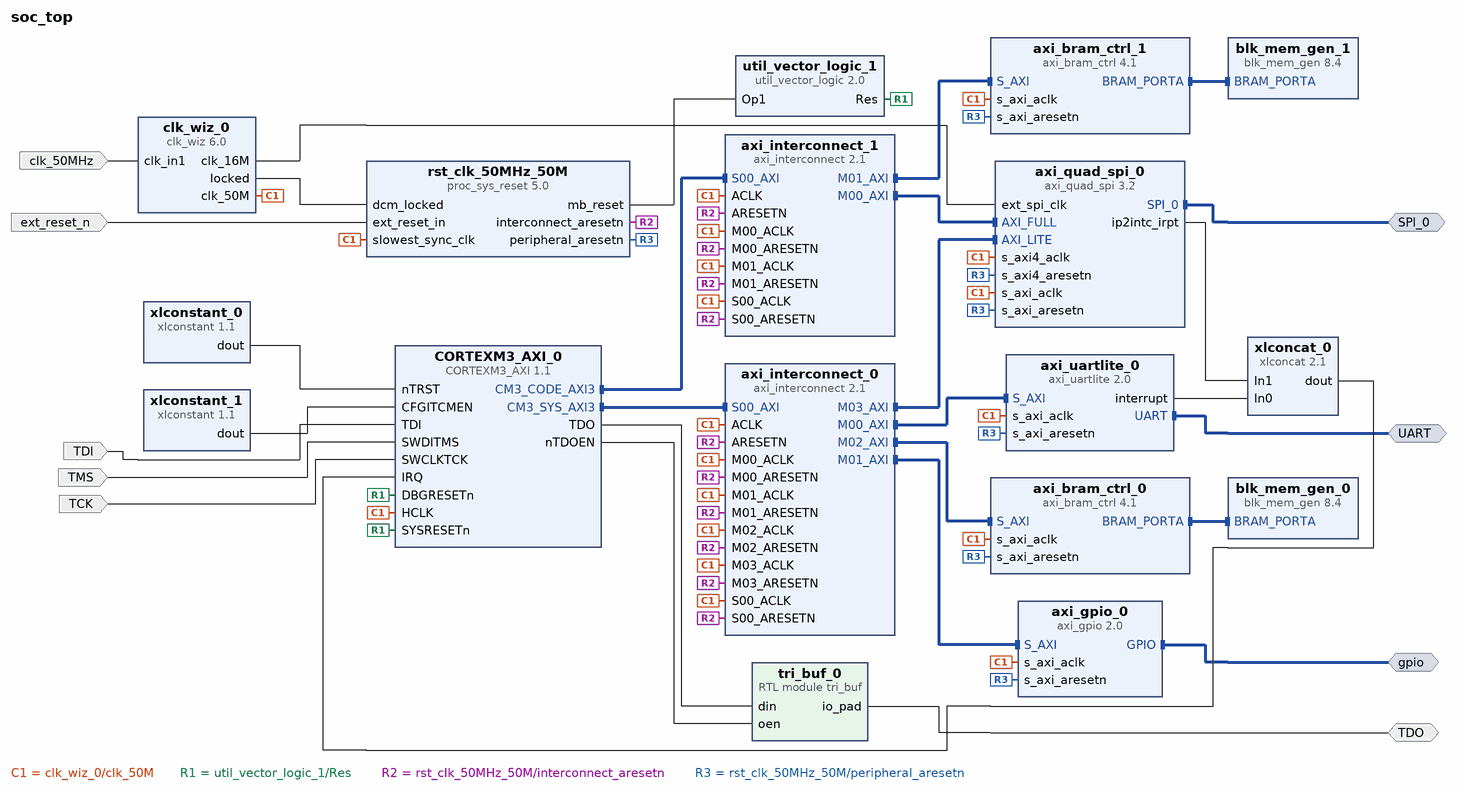
[diagram p0: block diagram of the top level]
# Vivado block design soc_top, xc7z020clg400-2, Vivado 2019.1
create_bd_design soc_top

create_bd_intf_port -mode Master -vlnv xilinx.com:interface:uart_rtl:1.0 UART
create_bd_intf_port -mode Master -vlnv xilinx.com:interface:spi_rtl:1.0 SPI_0
create_bd_intf_port -mode Master -vlnv xilinx.com:interface:gpio_rtl:1.0 gpio
create_bd_port -dir I -type clk clk_50MHz
set_property -dict {CONFIG.FREQ_HZ 50000000} [get_bd_ports clk_50MHz]
create_bd_port -dir I -type rst ext_reset_n
create_bd_port -dir I TMS
create_bd_port -dir I TDI
create_bd_port -dir IO TDO
create_bd_port -dir I -type clk TCK
set_property -dict {CONFIG.FREQ_HZ 10000000} [get_bd_ports TCK]

create_bd_cell -type ip -vlnv Arm.com:CortexM:CORTEXM3_AXI:1.1 CORTEXM3_AXI_0
create_bd_cell -type ip -vlnv xilinx.com:ip:proc_sys_reset:5.0 rst_clk_50MHz_50M
create_bd_cell -type ip -vlnv xilinx.com:ip:util_vector_logic:2.0 util_vector_logic_1
set_property -dict {CONFIG.C_OPERATION not CONFIG.C_SIZE 1} [get_bd_cells util_vector_logic_1]
create_bd_cell -type ip -vlnv xilinx.com:ip:xlconcat:2.1 xlconcat_0
create_bd_cell -type ip -vlnv xilinx.com:ip:axi_bram_ctrl:4.1 axi_bram_ctrl_1
set_property -dict {CONFIG.SINGLE_PORT_BRAM 1} [get_bd_cells axi_bram_ctrl_1]
create_bd_cell -type ip -vlnv xilinx.com:ip:axi_gpio:2.0 axi_gpio_0
create_bd_cell -type ip -vlnv xilinx.com:ip:axi_interconnect:2.1 axi_interconnect_0
set_property -dict {CONFIG.NUM_MI 4} [get_bd_cells axi_interconnect_0]
create_bd_cell -type ip -vlnv xilinx.com:ip:axi_interconnect:2.1 axi_interconnect_1
set_property -dict {CONFIG.NUM_MI 2} [get_bd_cells axi_interconnect_1]
create_bd_cell -type ip -vlnv xilinx.com:ip:axi_quad_spi:3.2 axi_quad_spi_0
set_property -dict [list \
  CONFIG.C_SPI_MODE 2 \
  CONFIG.C_TYPE_OF_AXI4_INTERFACE 1 \
  CONFIG.C_USE_STARTUP 0 \
  CONFIG.C_XIP_MODE 1 \
] [get_bd_cells axi_quad_spi_0]
create_bd_cell -type ip -vlnv xilinx.com:ip:axi_uartlite:2.0 axi_uartlite_0
set_property -dict {CONFIG.C_BAUDRATE 115200 CONFIG.C_S_AXI_ACLK_FREQ_HZ 50000000} [get_bd_cells axi_uartlite_0]
create_bd_cell -type ip -vlnv xilinx.com:ip:blk_mem_gen:8.4 blk_mem_gen_0
set_property -dict {CONFIG.EN_SAFETY_CKT false} [get_bd_cells blk_mem_gen_0]
create_bd_cell -type ip -vlnv xilinx.com:ip:blk_mem_gen:8.4 blk_mem_gen_1
set_property -dict {CONFIG.EN_SAFETY_CKT false} [get_bd_cells blk_mem_gen_1]
create_bd_cell -type ip -vlnv xilinx.com:ip:clk_wiz:6.0 clk_wiz_0
set_property -dict [list \
  CONFIG.CLKIN1_JITTER_PS 200.0 \
  CONFIG.CLKOUT1_JITTER 222.587 \
  CONFIG.CLKOUT1_PHASE_ERROR 144.334 \
  CONFIG.CLKOUT1_REQUESTED_OUT_FREQ 50.000 \
  CONFIG.CLKOUT2_JITTER 282.470 \
  CONFIG.CLKOUT2_PHASE_ERROR 144.334 \
  CONFIG.CLKOUT2_REQUESTED_OUT_FREQ 16.000 \
  CONFIG.CLKOUT2_USED true \
  CONFIG.CLK_OUT1_PORT clk_50M \
  CONFIG.CLK_OUT2_PORT clk_16M \
  CONFIG.MMCM_CLKFBOUT_MULT_F 16.000 \
  CONFIG.MMCM_CLKIN1_PERIOD 20.000 \
  CONFIG.MMCM_CLKIN2_PERIOD 10.0 \
  CONFIG.MMCM_CLKOUT0_DIVIDE_F 16.000 \
  CONFIG.MMCM_CLKOUT1_DIVIDE 50 \
  CONFIG.NUM_OUT_CLKS 2 \
  CONFIG.PRIM_IN_FREQ 50.000 \
  CONFIG.USE_RESET false \
] [get_bd_cells clk_wiz_0]
create_bd_cell -type ip -vlnv xilinx.com:ip:xlconstant:1.1 xlconstant_0
create_bd_cell -type ip -vlnv xilinx.com:ip:xlconstant:1.1 xlconstant_1
set_property -dict {CONFIG.CONST_VAL b01 CONFIG.CONST_WIDTH 2} [get_bd_cells xlconstant_1]
create_bd_cell -type ip -vlnv xilinx.com:ip:axi_bram_ctrl:4.1 axi_bram_ctrl_0
set_property -dict {CONFIG.SINGLE_PORT_BRAM 1} [get_bd_cells axi_bram_ctrl_0]
create_bd_cell -type module -reference tri_buf tri_buf_0

# ---- connections ----

connect_bd_intf_net [get_bd_intf_pins axi_bram_ctrl_1/BRAM_PORTA] [get_bd_intf_pins blk_mem_gen_1/BRAM_PORTA]
connect_bd_intf_net [get_bd_intf_pins axi_interconnect_0/M01_AXI] [get_bd_intf_pins axi_gpio_0/S_AXI]
connect_bd_intf_net [get_bd_intf_pins axi_interconnect_1/S00_AXI] [get_bd_intf_pins CORTEXM3_AXI_0/CM3_CODE_AXI3]
connect_bd_intf_net [get_bd_intf_ports gpio] [get_bd_intf_pins axi_gpio_0/GPIO]
connect_bd_intf_net [get_bd_intf_pins axi_interconnect_1/M01_AXI] [get_bd_intf_pins axi_bram_ctrl_1/S_AXI]
connect_bd_intf_net [get_bd_intf_pins CORTEXM3_AXI_0/CM3_SYS_AXI3] [get_bd_intf_pins axi_interconnect_0/S00_AXI]
connect_bd_intf_net [get_bd_intf_ports SPI_0] [get_bd_intf_pins axi_quad_spi_0/SPI_0]
connect_bd_intf_net [get_bd_intf_pins axi_interconnect_0/M03_AXI] [get_bd_intf_pins axi_quad_spi_0/AXI_LITE]
connect_bd_intf_net [get_bd_intf_ports UART] [get_bd_intf_pins axi_uartlite_0/UART]
connect_bd_intf_net [get_bd_intf_pins blk_mem_gen_0/BRAM_PORTA] [get_bd_intf_pins axi_bram_ctrl_0/BRAM_PORTA]
connect_bd_intf_net [get_bd_intf_pins axi_interconnect_0/M00_AXI] [get_bd_intf_pins axi_uartlite_0/S_AXI]
connect_bd_intf_net [get_bd_intf_pins axi_interconnect_1/M00_AXI] [get_bd_intf_pins axi_quad_spi_0/AXI_FULL]
connect_bd_intf_net [get_bd_intf_pins axi_bram_ctrl_0/S_AXI] [get_bd_intf_pins axi_interconnect_0/M02_AXI]
connect_bd_net [get_bd_ports clk_50MHz] [get_bd_pins clk_wiz_0/clk_in1]
connect_bd_net [get_bd_pins clk_wiz_0/locked] [get_bd_pins rst_clk_50MHz_50M/dcm_locked]
connect_bd_net -net clk_wiz_0_clk_out1 [get_bd_pins clk_wiz_0/clk_50M] \
  [get_bd_pins rst_clk_50MHz_50M/slowest_sync_clk] [get_bd_pins CORTEXM3_AXI_0/HCLK] [get_bd_pins axi_bram_ctrl_1/s_axi_aclk] \
  [get_bd_pins axi_gpio_0/s_axi_aclk] [get_bd_pins axi_interconnect_0/ACLK] [get_bd_pins axi_interconnect_0/S00_ACLK] \
  [get_bd_pins axi_interconnect_0/M00_ACLK] [get_bd_pins axi_interconnect_0/M01_ACLK] \
  [get_bd_pins axi_interconnect_0/M02_ACLK] [get_bd_pins axi_interconnect_0/M03_ACLK] [get_bd_pins axi_interconnect_1/ACLK] \
  [get_bd_pins axi_interconnect_1/S00_ACLK] [get_bd_pins axi_interconnect_1/M00_ACLK] \
  [get_bd_pins axi_interconnect_1/M01_ACLK] [get_bd_pins axi_quad_spi_0/s_axi_aclk] [get_bd_pins axi_quad_spi_0/s_axi4_aclk] \
  [get_bd_pins axi_uartlite_0/s_axi_aclk] [get_bd_pins axi_bram_ctrl_0/s_axi_aclk]
connect_bd_net [get_bd_pins rst_clk_50MHz_50M/mb_reset] [get_bd_pins util_vector_logic_1/Op1]
connect_bd_net [get_bd_pins util_vector_logic_1/Res] [get_bd_pins CORTEXM3_AXI_0/SYSRESETn] [get_bd_pins CORTEXM3_AXI_0/DBGRESETn]
connect_bd_net [get_bd_pins rst_clk_50MHz_50M/interconnect_aresetn] \
  [get_bd_pins axi_interconnect_0/ARESETN] [get_bd_pins axi_interconnect_0/S00_ARESETN] \
  [get_bd_pins axi_interconnect_0/M00_ARESETN] [get_bd_pins axi_interconnect_0/M01_ARESETN] \
  [get_bd_pins axi_interconnect_0/M02_ARESETN] [get_bd_pins axi_interconnect_0/M03_ARESETN] \
  [get_bd_pins axi_interconnect_1/ARESETN] [get_bd_pins axi_interconnect_1/S00_ARESETN] \
  [get_bd_pins axi_interconnect_1/M00_ARESETN] [get_bd_pins axi_interconnect_1/M01_ARESETN]
connect_bd_net -net util_vector_logic_3_Res [get_bd_pins rst_clk_50MHz_50M/peripheral_aresetn] \
  [get_bd_pins axi_bram_ctrl_1/s_axi_aresetn] [get_bd_pins axi_gpio_0/s_axi_aresetn] \
  [get_bd_pins axi_quad_spi_0/s_axi_aresetn] [get_bd_pins axi_quad_spi_0/s_axi4_aresetn] \
  [get_bd_pins axi_uartlite_0/s_axi_aresetn] [get_bd_pins axi_bram_ctrl_0/s_axi_aresetn]
connect_bd_net [get_bd_pins axi_uartlite_0/interrupt] [get_bd_pins xlconcat_0/In0]
connect_bd_net [get_bd_pins xlconstant_0/dout] [get_bd_pins CORTEXM3_AXI_0/nTRST]
connect_bd_net [get_bd_pins xlconcat_0/dout] [get_bd_pins CORTEXM3_AXI_0/IRQ]
connect_bd_net [get_bd_pins axi_quad_spi_0/ip2intc_irpt] [get_bd_pins xlconcat_0/In1]
connect_bd_net [get_bd_pins xlconstant_1/dout] [get_bd_pins CORTEXM3_AXI_0/CFGITCMEN]
connect_bd_net [get_bd_pins clk_wiz_0/clk_16M] [get_bd_pins axi_quad_spi_0/ext_spi_clk]
connect_bd_net [get_bd_ports ext_reset_n] [get_bd_pins rst_clk_50MHz_50M/ext_reset_in]
connect_bd_net -net bscan_jtag_v1_0_0_bs_0_JTAG_TDI [get_bd_ports TDI] [get_bd_pins CORTEXM3_AXI_0/TDI]
connect_bd_net -net bscan_jtag_v1_0_0_bs_0_JTAG_TMS [get_bd_ports TMS] [get_bd_pins CORTEXM3_AXI_0/SWDITMS]
connect_bd_net [get_bd_pins CORTEXM3_AXI_0/TDO] [get_bd_pins tri_buf_0/din]
connect_bd_net [get_bd_pins CORTEXM3_AXI_0/nTDOEN] [get_bd_pins tri_buf_0/oen]
connect_bd_net [get_bd_ports TDO] [get_bd_pins tri_buf_0/io_pad]
connect_bd_net [get_bd_ports TCK] [get_bd_pins CORTEXM3_AXI_0/SWCLKTCK]

# ---- address map ----
assign_bd_address -offset 0x01000000 -range 1M -target_address_space [get_bd_addr_spaces CORTEXM3_AXI_0/CM3_CODE_AXI3] [get_bd_addr_segs axi_quad_spi_0/aximm/MEM0]
assign_bd_address -offset 0x02000000 -range 8K -target_address_space [get_bd_addr_spaces CORTEXM3_AXI_0/CM3_CODE_AXI3] [get_bd_addr_segs axi_bram_ctrl_1/S_AXI/Mem0]
assign_bd_address -offset 0x40100000 -range 64K -target_address_space [get_bd_addr_spaces CORTEXM3_AXI_0/CM3_SYS_AXI3] [get_bd_addr_segs axi_gpio_0/S_AXI/Reg]
assign_bd_address -offset 0x40110000 -range 64K -target_address_space [get_bd_addr_spaces CORTEXM3_AXI_0/CM3_SYS_AXI3] [get_bd_addr_segs axi_uartlite_0/S_AXI/Reg]
assign_bd_address -offset 0x40120000 -range 64K -target_address_space [get_bd_addr_spaces CORTEXM3_AXI_0/CM3_SYS_AXI3] [get_bd_addr_segs axi_quad_spi_0/AXI_LITE/Reg]
assign_bd_address -offset 0x60000000 -range 8K -target_address_space [get_bd_addr_spaces CORTEXM3_AXI_0/CM3_SYS_AXI3] [get_bd_addr_segs axi_bram_ctrl_0/S_AXI/Mem0]

validate_bd_design
save_bd_design
